# EAGLE schematic controller9 (EAGLE 8.1.1)

## Sheet 1 of 2
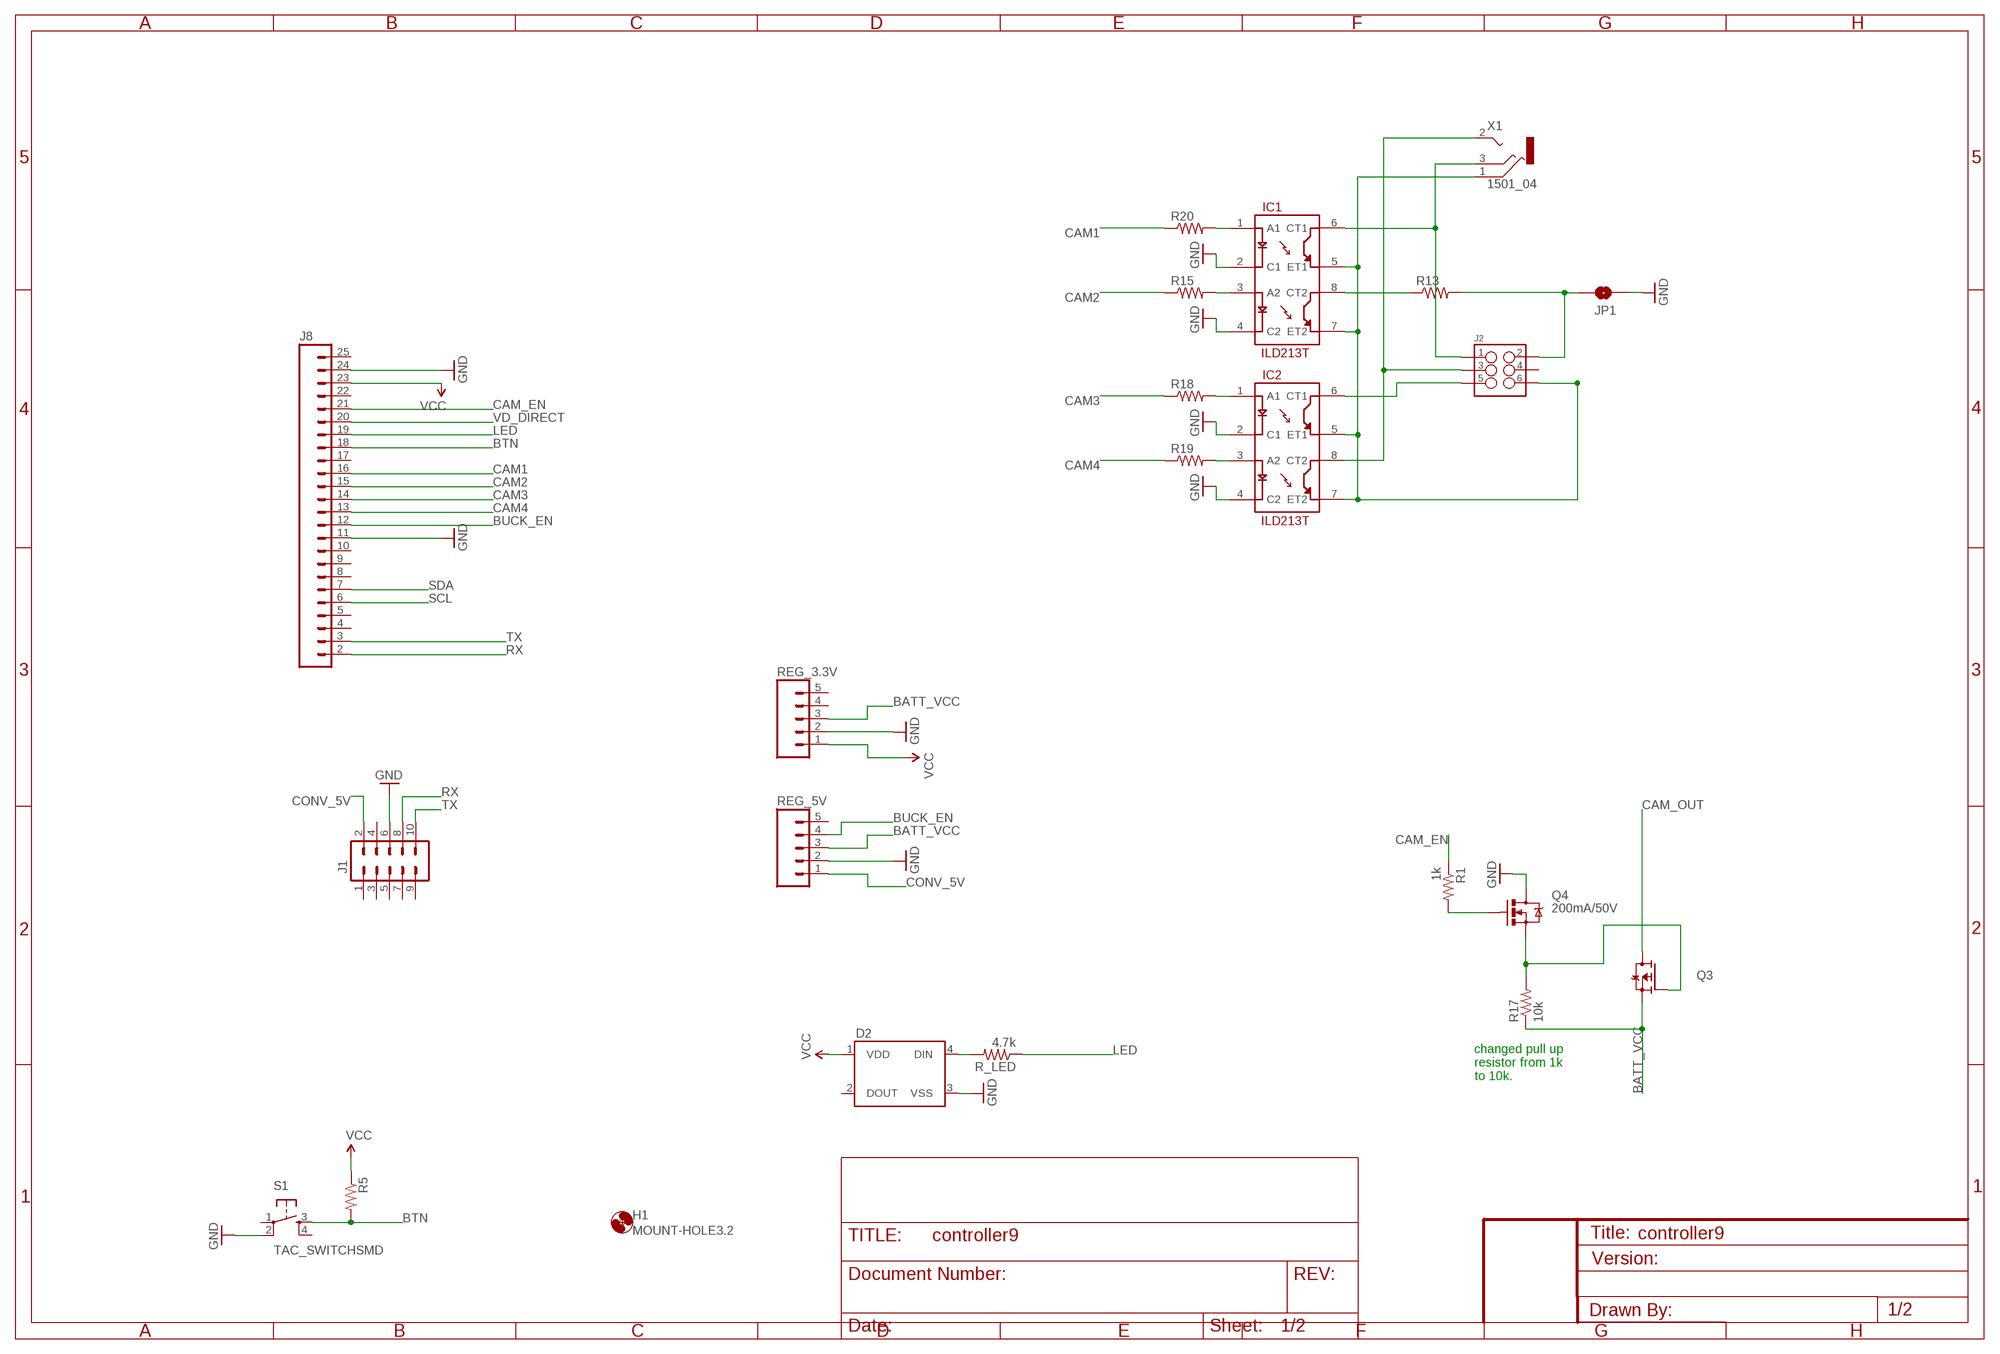
[diagram p0: schematic, sheet 1]

### Parts
D2  WS2812B  [WS2812B]
H1  MOUNT-HOLE3.2  [3,2]
IC1  ILD213T  [SO08]
IC2  ILD213T  [SO08]
J1  M05X2PTH  [AVR_ICSP]
J2  M03X2FEMALE  [2X3]
J8  M24LOCK  [1X24_LOCK]
JP1  JUMPER-PAD-2-NOYES_SILK  [PAD-JUMPER-2-NO_YES_SILK]
Q3  FDD4141TO252  [TO252]
Q4  200mA/50V  MOSFET-NCHANNELBSS138  [SOT23-3]
R1  1k  RESISTOR0805-RES  [0805]
R5  RESISTOR0805-RES  [0805]
R13  RESISTOR0805-RES  [0805]
R15  RESISTOR0805-RES  [0805]
R17  10k  RESISTOR0805-RES  [0805]
R18  RESISTOR0805-RES  [0805]
R19  RESISTOR0805-RES  [0805]
R20  RESISTOR0805-RES  [0805]
R_LED  4.7k  RESISTOR0805-RES  [0805]
REG_3.3V  M05LOCK  [1X05_LOCK]
REG_5V  M05LOCK  [1X05_LOCK]
S1  TAC_SWITCHSMD  TAC_SWITCHPTH  [TACTILE-PTH]
X1  1501_04  [1501_05]

### Nets
BATT_VCC [camera_power]: Q3.2(S) R17.1 REG_3.3V.3 REG_5V.3 ; also sheet 2
BTN: J8.18 R5.2 S1.3
BUCK_EN: J8.12 REG_5V.4
CAM1: J8.16 R20.1
CAM2: J8.15 R15.1
CAM3: J8.14 R18.1
CAM4: J8.13 R19.1
CAM_EN: J8.21 R1.1
CAM_OUT [camera_power]: Q3.3(D) ; also sheet 2
CONV_5V [power]: J1.2 REG_5V.1
GND [power]: D2.3(VSS) IC1.2(C1) IC1.4(C2) IC2.2(C1) IC2.4(C2) J1.6 J8.11 J8.24 JP1.1 Q4.3(D) REG_3.3V.2 REG_5V.2 S1.2 ; also sheet 2
LED: J8.19 R_LED.1
N$2: Q4.1(G) R1.2
N$3: Q3.1(G) Q4.2(S) R17.2
N$4: IC1.5(ET1) IC1.7(ET2) IC2.5(ET1) IC2.7(ET2) J2.6 X1.1
N$7: D2.4(DIN) R_LED.2
N$12: IC2.1(A1) R18.2
N$13: IC2.3(A2) R19.2
N$15: IC1.3(A2) R15.2
N$16: J2.2 JP1.2 R13.2
N$18: IC1.8(CT2) R13.1
N$19: IC1.1(A1) R20.2
N$31: IC1.6(CT1) J2.1 X1.3
N$32: IC2.8(CT2) J2.3 X1.2
N$33: IC2.6(CT1) J2.5
RX: J1.8 J8.2
SCL: J8.6
SDA: J8.7
TX: J1.10 J8.3
VCC [power]: D2.1(VDD) J8.23 R5.1 REG_3.3V.1
VD_DIRECT: J8.20 ; also sheet 2
Unconnected: D2.2(DOUT) J1.1 J1.3 J1.4 J1.5 J1.7 J1.9 J2.4 J8.4 J8.5 J8.8 J8.9 J8.10 J8.17 J8.22 J8.25 REG_3.3V.4 REG_3.3V.5 REG_5V.5 S1.1 S1.4

### Notes on the sheet
- changed pull up
  resistor from 1k
  to 10k.

## Sheet 2 of 2
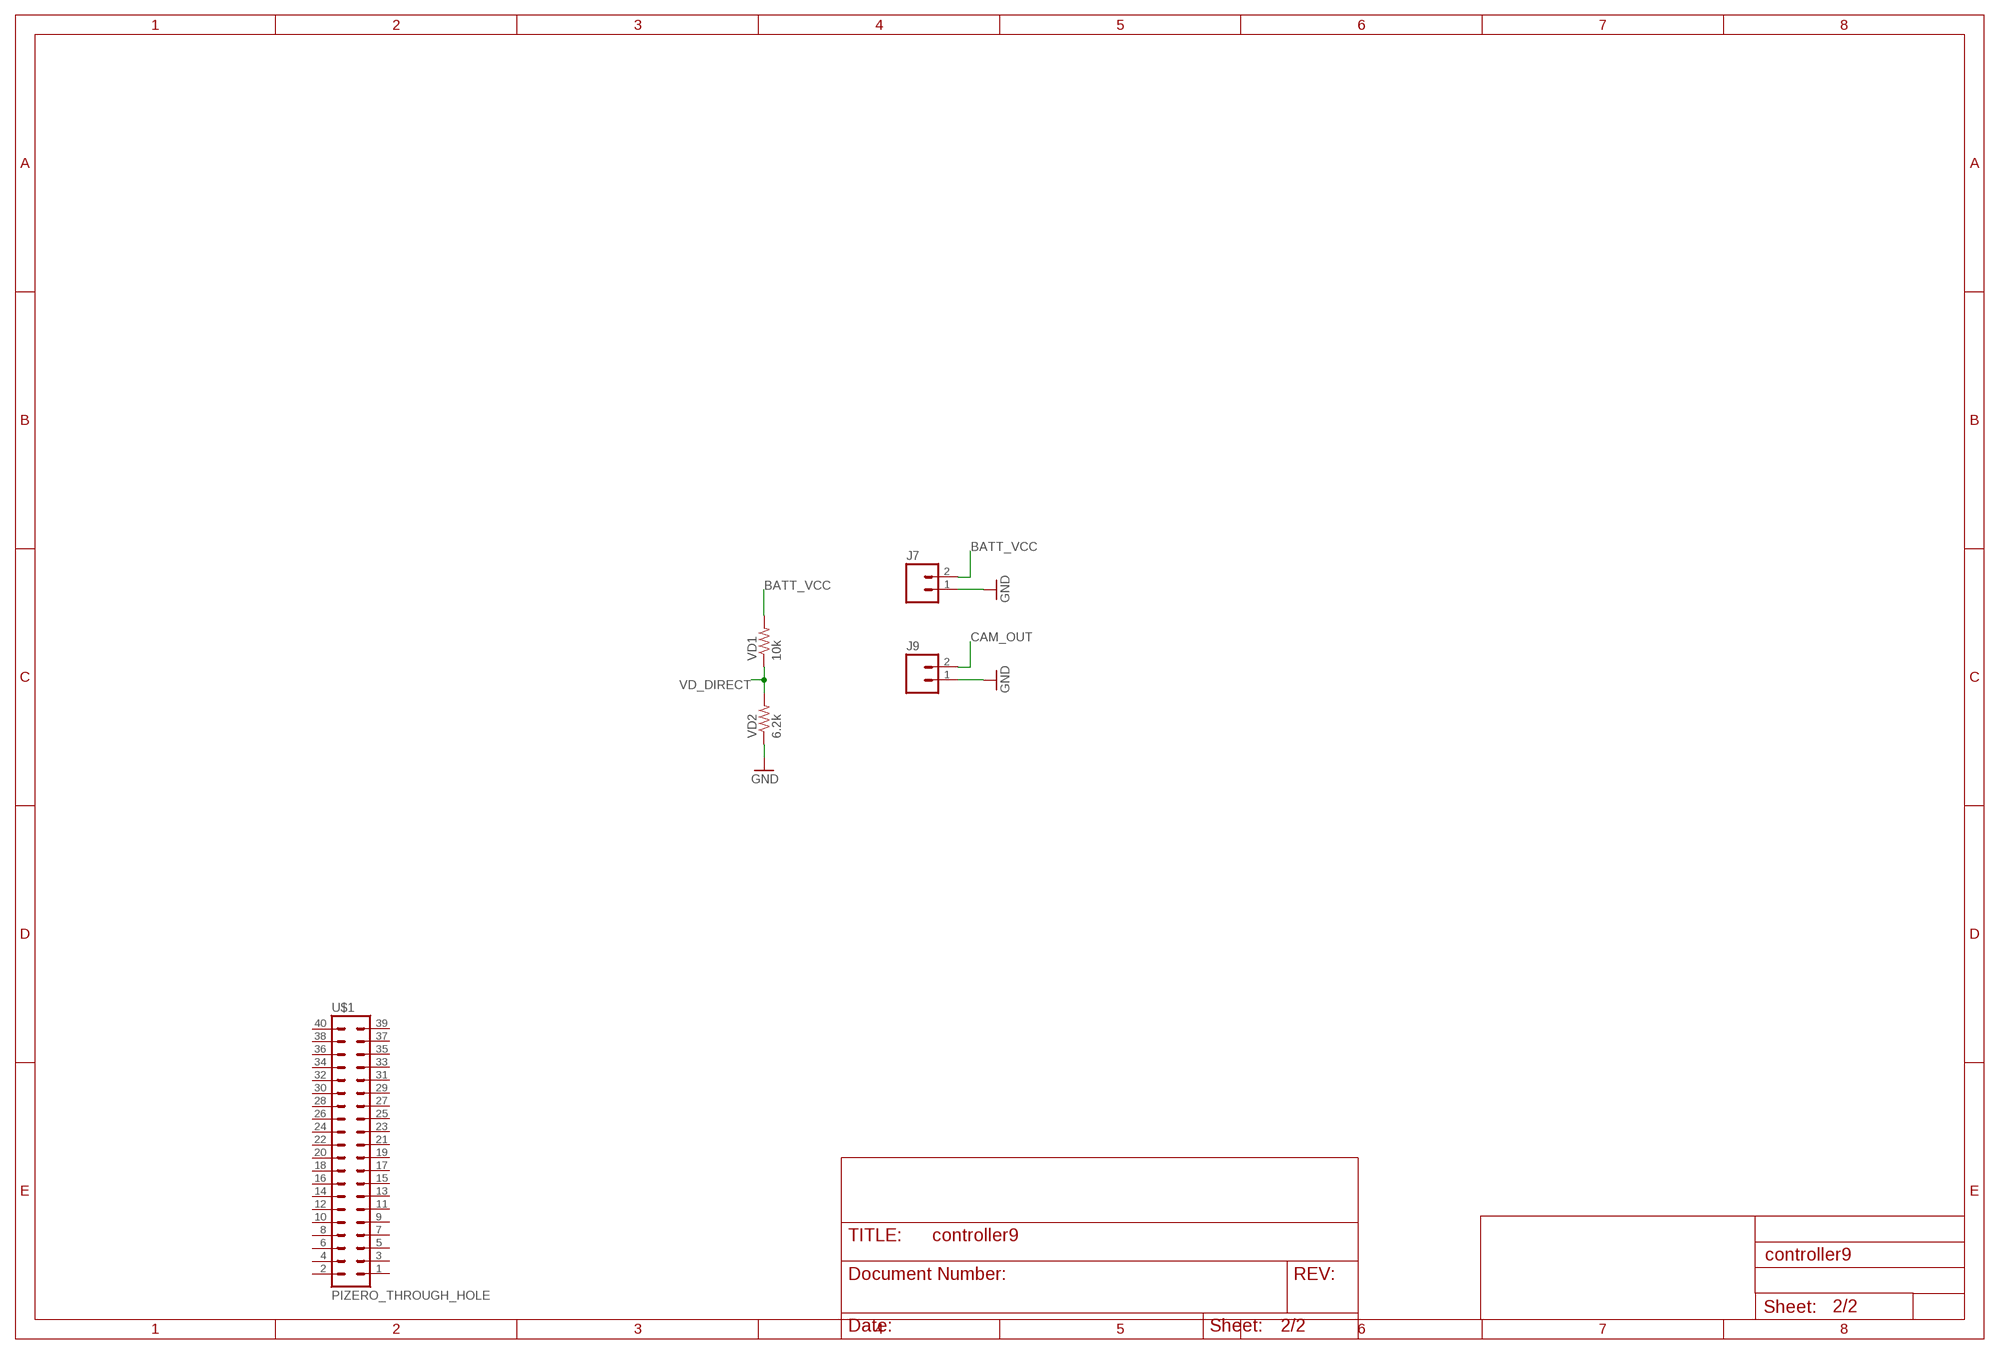
[diagram p1: schematic, sheet 2]

### Parts
J7  M02LOCK  [1X02_LOCK]
J9  M02LOCK  [1X02_LOCK]
U$1  PIZERO_THROUGH_HOLE  [PIZERO_THOUGH_HOLE]
VD1  10k  RESISTOR0805-RES  [0805]
VD2  6.2k  RESISTOR0805-RES  [0805]

### Nets
BATT_VCC [camera_power]: J7.2 VD1.2 ; also sheet 1
CAM_OUT [camera_power]: J9.2 ; also sheet 1
GND [power]: J7.1 J9.1 VD2.1 ; also sheet 1
VD_DIRECT: VD1.1 VD2.2 ; also sheet 1
Unconnected: U$1.1 U$1.2 U$1.3 U$1.4 U$1.5 U$1.6 U$1.7 U$1.8 U$1.9 U$1.10 U$1.11 U$1.12 U$1.13 U$1.14 U$1.15 U$1.16 U$1.17 U$1.18 U$1.19 U$1.20 U$1.21 U$1.22 U$1.23 U$1.24 U$1.25 U$1.26 U$1.27 U$1.28 U$1.29 U$1.30 U$1.31 U$1.32 U$1.33 U$1.34 U$1.35 U$1.36 U$1.37 U$1.38 U$1.39 U$1.40

## Library data of the parts
D2 = SparkFun-LED:WS2812B: WS2812B - Intelligent control LED integrated light source Technical Specifications: Power Supply Voltage (VDD): 3.5 to 5.3 V Input Voltage (VI): -0.5 to VDD+0.5 V Operating Junction Temperature (Topt): -25°C to +80°C Storage Temperature Range (Tstg): -55°C to +150°C; PROD_ID: DIO-12503
H1 = holes:MOUNT-HOLE: MOUNTING HOLE with drill center marker
IC1 IC2 = SparkFun-DiscreteSemi:ILD213T: Dual optoisolator.
J1 = SparkFun-Connectors:M05X2: Header 5x2 Standard 10-pin dual row 0.1" header. Commonly used with AVR-ISP. Use with Spark Fun Electronics SKU: PRT-00778
J2 = SparkFun-Connectors:M03X2: 2x3 .1" header. Shrouded, with keying- CONN-10681 SMT- CONN-11415 Pogo pins- HW-11044; PROD_ID: CONN-11566; VALUE: FEMALE 2x3
J7 J9 = SparkFun-Connectors:M02: Standard 2-pin 0.1" header. Use with - straight break away headers ( PRT-00116) - right angle break away headers (PRT-00553) - swiss pins (PRT-00743) - machine pins (PRT-00117) - female headers (PRT-00115) Molex polarized connector foot print use with: PRT-08233 with associated crimp pins and housings. 2.54_SCREWTERM for use with PRT-10571. 3.5mm Screw Terminal footprints for PRT-08084 5mm Screw Terminal footprints for use with PRT-08432
J8 = SparkFun-Connectors:M24: 1x24 .1" header
JP1 = SparkFun-Passives:JUMPER-PAD-2-NO
Q3 = transistor-fet:FDD4141: P-Channel PowerTrench® MOSFET Source: FDD4141.pdf
Q4 = SparkFun-DiscreteSemi:MOSFET-NCHANNEL: Common NMOSFET Parts MFG P/N Store ID Prod ID FDD8780 TRANS-09984 SI7820DN TRANS-11055 FDS6630A IC-08089 2N7002PW TRANS-11151 FQP30N06L COM-10213 TRANS-10060 BSS123LT1G TRANS-08345 BSS138 TRANS-00830 BS170 2N7000; PROD_ID: TRANS-00830
R1 R17 R_LED = SparkFun-Resistors:RESISTOR: Resistor Basic schematic elements and footprints for 0603, 1206, and PTH resistors.
R5 R13 R15 R18-R20 VD1 VD2 = SparkFun-Passives:RESISTOR: Resistor Basic schematic elements and footprints for 0603, 1206, and PTH resistors.
REG_3.3V REG_5V = SparkFun-Connectors:M05: Header 5 Standard 5-pin 0.1" header. Use with straight break away headers (SKU : PRT-00116), right angle break away headers (PRT-00553), swiss pins (PRT-00743), machine pins (PRT-00117), and female headers (PRT-00115). Molex polarized connector foot print use with SKU : PRT-08230 with associated crimp pins and housings.
S1 = SparkFun-Retired:TAC_SWITCH: Momentary Switch Button commonly used for reset or general input. Spark Fun Electronics SKU : COM-00097 SMT- SWCH-08247
U$1 = pizero:PIZERO_THROUGH_HOLE
X1 = con-lumberg:1501_0*: Jack connectors according to JISC 6560, 2.5 mm Klinkensteckverbinder nach JISC 6560, 2,5 mm Source: http://www.lumberg.com/Produkte/PDFs/1501_05.pdfedit 1501_03 http://www.lumberg.com/Produkte/PDFs/1501_06.pdf; OC_FARNELL: 1216977; OC_NEWARK: unknown

## Net classes
0 default: width 0.254 mm, clearance 0.254 mm
1 power: width 0.356 mm, clearance 0.254 mm
2 camera_power: width 0.66 mm, clearance 0.254 mm
3 usbsignal: width 0.254 mm, clearance 0.203 mm